# EAGLE design relayChain5Control (EAGLE 9.2.2)
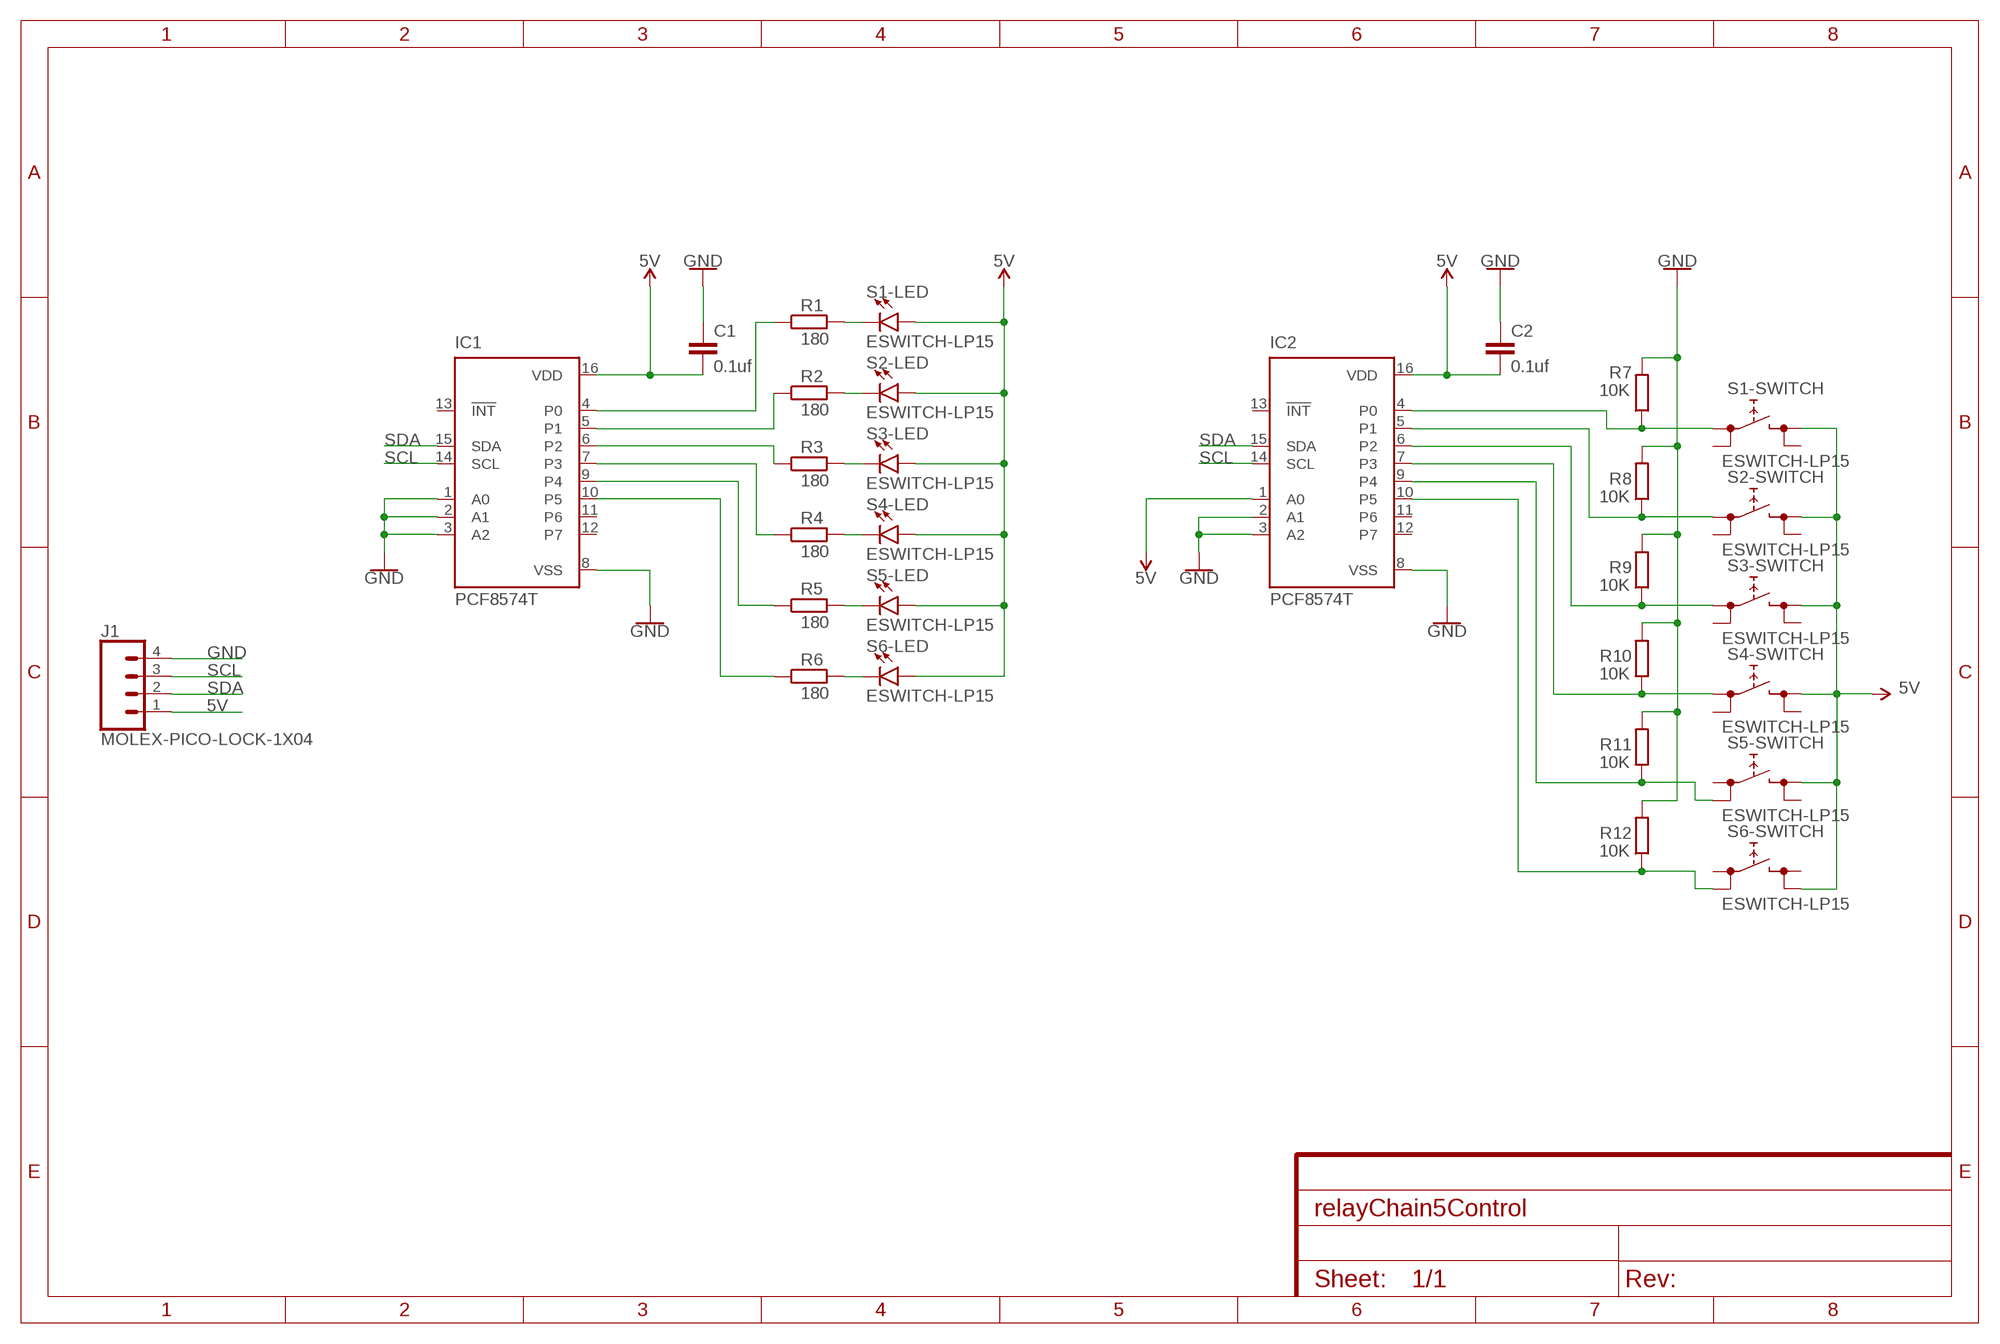
[diagram p0: schematic, sheet 1]

## Parts
C1  0.1uf  C-EUC0805  [C0805]
C2  0.1uf  C-EUC0805  [C0805]
IC1  PCF8574T  [SO16W]
IC2  PCF8574T  [SO16W]
J1  MOLEX-PICO-LOCK-1X04  [MOLEX-PICO-LOCK-1X04]
R1  180  R-EU_R2012  [R2012]
R2  180  R-EU_R2012  [R2012]
R3  180  R-EU_R2012  [R2012]
R4  180  R-EU_R2012  [R2012]
R5  180  R-EU_R2012  [R2012]
R6  180  R-EU_R2012  [R2012]
R7  10K  R-EU_R2012  [R2012]
R8  10K  R-EU_R2012  [R2012]
R9  10K  R-EU_R2012  [R2012]
R10  10K  R-EU_R2012  [R2012]
R11  10K  R-EU_R2012  [R2012]
R12  10K  R-EU_R2012  [R2012]
S1  ESWITCH-LP15  [ESWITCH-LP15]
S2  ESWITCH-LP15  [ESWITCH-LP15]
S3  ESWITCH-LP15  [ESWITCH-LP15]
S4  ESWITCH-LP15  [ESWITCH-LP15]
S5  ESWITCH-LP15  [ESWITCH-LP15]
S6  ESWITCH-LP15  [ESWITCH-LP15]

## Nets
5V: C1.2 C2.2 IC1.16(VDD) IC2.1(A0) IC2.16(VDD) J1.1 S1.P$3 S1.P$5(-LED:A) S2.P$3 S2.P$5(-LED:A) S3.P$3 S3.P$5(-LED:A) S4.P$3 S4.P$5(-LED:A) S5.P$3 S5.P$5(-LED:A) S6.P$4 S6.P$5(-LED:A)
GND: C1.1 C2.1 IC1.1(A0) IC1.2(A1) IC1.3(A2) IC1.8(VSS) IC2.2(A1) IC2.3(A2) IC2.8(VSS) J1.4 R7.2 R8.2 R9.2 R10.2 R11.2 R12.2
N$1: IC1.4(P0) R1.1
N$2: R1.2 S1.P$6(-LED:C)
N$3: IC1.5(P1) R2.1
N$4: IC1.6(P2) R3.1
N$5: IC2.4(P0) R7.1 S1.P$1
N$6: IC2.5(P1) R8.1 S2.P$1
N$7: R2.2 S2.P$6(-LED:C)
N$8: IC2.6(P2) R9.1 S3.P$1
N$9: IC2.7(P3) R10.1 S4.P$1
N$10: IC2.9(P4) R11.1 S5.P$2
N$11: IC1.7(P3) R4.1
N$12: IC1.9(P4) R5.1
N$13: R3.2 S3.P$6(-LED:C)
N$14: IC2.10(P5) R12.1 S6.P$2
N$15: R4.2 S4.P$6(-LED:C)
N$16: R5.2 S5.P$6(-LED:C)
N$17: R6.2 S6.P$6(-LED:C)
N$18: IC1.10(P5) R6.1
SCL: IC1.14(SCL) IC2.14(SCL) J1.3
SDA: IC1.15(SDA) IC2.15(SDA) J1.2
Unconnected: IC1.11(P6) IC1.12(P7) IC1.13(!INT) IC2.11(P6) IC2.12(P7) IC2.13(!INT) S1.P$2 S1.P$4 S2.P$2 S2.P$4 S3.P$2 S3.P$4 S4.P$2 S4.P$4 S5.P$1 S5.P$4 S6.P$1 S6.P$3

## Library data of the parts
C1 C2 = rcl:C-EU: CAPACITOR, European symbol; SPICEPREFIX: C
IC1 IC2 = micro-philips:PCF8574: I2C-Bus Remote 8-bit I/O expander http://www.semiconductors.philips.com/acrobat_download/datasheets/PCF8574_4.pdf; MPN: PCF8574T/3,512; OC_FARNELL: 1201255; OC_NEWARK: 70R6870
J1 = My-SMD-Library:MOLEX-PICO-LOCK-1X04
R1-R12 = rcl:R-EU_: RESISTOR, European symbol; SPICEPREFIX: R
S1-S6 = My-SMD-Library:ESWITCH-LP15?*

## Board
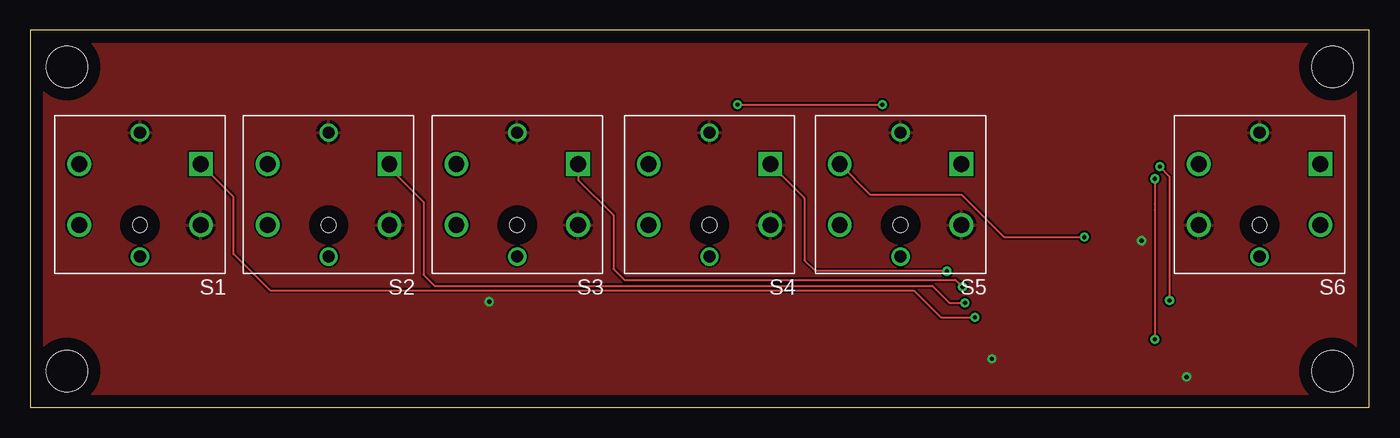
[diagram p1: board, top side]
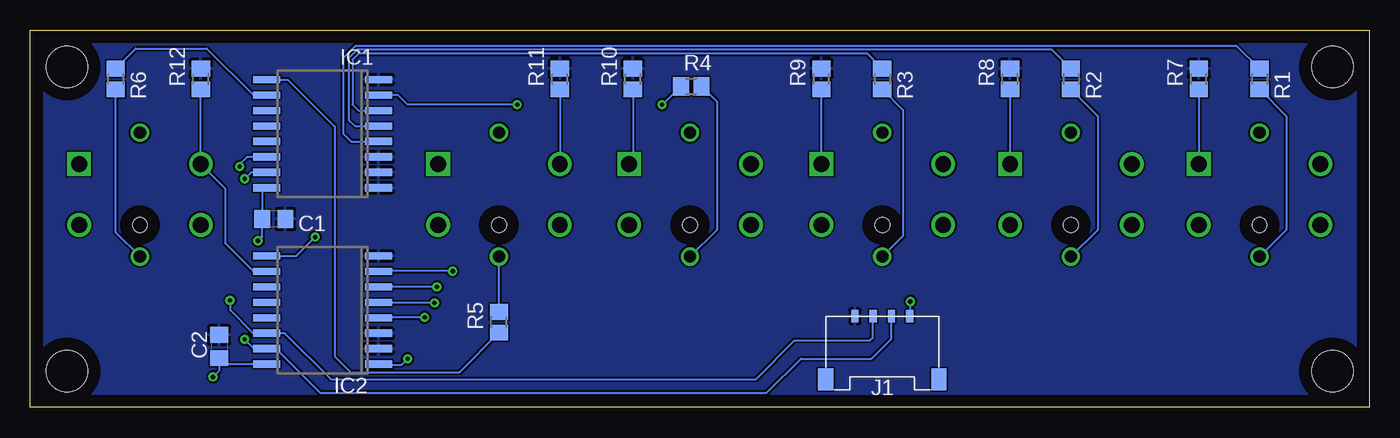
[diagram p2: board, bottom side, seen from below]

Size 110 x 31 mm. Coordinates in mm from the lower left corner, seen from the top.
Outline: 0,0 110,0 110,31 0,31 0,0
Copper layers (1*16): Top 0.035mm / dielectric 1.5mm / Bottom 0.035mm
Design rules "default": minimum track width 6mil, minimum drill 0.35mm, track to track 6mil, track to pad 6mil, pad to pad 6mil, via to via 6mil, smd to smd 6mil, copper to edge 40mil, drill to drill 6mil, minimum pad ring 10mil, minimum via ring 8mil, stop-mask expansion 4mil, vias tented up to drill 0mil, thermal gap 10mil
Holes 3.4 mm at 3,3 3,28 107,28 107,3

### Footprints (pad centres in the part's own frame; a part is rotated, then mirrored left to right if it is on the bottom)
C0805 = smd 1.3 x 1.5: 1 -0.95,0; 2 0.95,0
SO16W = smd 0.6 x 2.2: 1 -4.445,-4.6; 2 -3.175,-4.6; 3 -1.905,-4.6; 4 -0.635,-4.6; 5 0.635,-4.6; 6 1.905,-4.6; 7 3.175,-4.6; 8 4.445,-4.6; 9 4.445,4.6; 10 3.175,4.6; 11 1.905,4.6; 12 0.635,4.6; 13 -0.635,4.6; 14 -1.905,4.6; 15 -3.175,4.6; 16 -4.445,4.6
MOLEX-PICO-LOCK-1X04 = smd 0.6 x 1: 1 -2.25,0; 2 -0.75,0; 3 0.75,0; 4 2.25,0 | smd 1.25 x 1.8: S1 -4.65,5.2; S2 4.65,5.2
R2012 = smd 1.3 x 1.5: 1 -0.85,0; 2 0.85,0
ESWITCH-LP15 = drill 1.3 square: P$1 -5,-5 | drill 1.3: P$2 5,-5; P$3 -5,0; P$4 5,0 | drill 1: P$5 0,-7.6; P$6 0,2.6 | hole 1.2: 0,0

### Placement (x,y rotation side)
C1  90,15.5 180 bottom
C2  94.5,5 270 bottom
IC1  86,22.5 90 bottom
IC2  86,8 90 bottom
J1  40,7.5 180 bottom
R1  9,27 270 bottom
R2  24.5,27 270 bottom
R3  40,27 270 bottom
R4  55.7,26.4 0 bottom
R5  71.5,7 90 bottom
R6  103,27 270 bottom
R7  14,27 90 bottom
R8  29.5,27 90 bottom
R9  45,27 90 bottom
R10  60.5,27 90 bottom
R11  66.5,27 90 bottom
R12  96,27 90 bottom
S1  9,15 180 top
S2  24.5,15 180 top
S3  40,15 180 top
S4  55.8,15 180 top
S5  71.5,15 180 top
S6  101,15 180 top

### Tracks (layer width: path | path; a pad name or v marks a point on that pad's centre or on a via)
5V  (via drill 0.35)
  Bottom 0.152: J1.1 37.7,7.55 v37.7,8.7 | IC2.16 94,3.56 C2.2 94.5,3 v95,2.5 | IC2.1 81.34,3.5 79.5,3.5 v79,4 | IC1.16 90.95,17.7 C1.2 90.95,14.05 v91.3,13.7
  pour Top: 0.5,30.5 109.5,30.5 109.5,0.5 0.5,0.5
GND
  pour Bottom: 0.5,30.5 0.5,0.5 109.5,0.5 109.5,30.5
N$1
  Bottom 0.152: R1.1 10.85,29.7 83.3,29.7 84.3,28.7 84.3,22.5 83.67,21.86 IC1.4
N$2
  Bottom 0.152: R1.2 6.8,23.95 6.8,14.6 S1.P$6
N$3
  Bottom 0.152: R2.1 26.05,29.39 83.17,29.39 83.83,28.73 83.83,23.63 83.33,23.14 IC1.5
N$4
  Bottom 0.152: R3.1 41.24,29.09 83.05,29.09 83.53,28.61 83.53,24.9 83.03,24.41 IC1.6
N$5  (via drill 0.35)
  Top 0.152: v77.6,7.4 74.8,7.4 72.6,9.6 19.7,9.6 16.7,12.6 16.7,17.3 S1.P$1
  Bottom 0.152: R7.1 S1.P$1 | v77.6,7.4 81.36,7.4 IC2.4
N$6  (via drill 0.35)
  Top 0.152: v76.8,8.6 75.5,8.6 74.1,10 33.2,10 32.3,10.9 32.3,16.9 29.5,19.7 S2.P$1
  Bottom 0.152: v76.8,8.6 81.36,8.6 IC2.5 | R8.1 S2.P$1
N$7
  Bottom 0.152: R2.2 22.3,23.95 22.3,14.6 S2.P$6
N$8  (via drill 0.35)
  Top 0.152: S3.P$1 45,18.7 47.9,15.8 47.9,11.4 48.8,10.5 76,10.5 v76.6,9.9
  Bottom 0.152: v76.6,9.9 IC2.6 | S3.P$1 R9.1
N$9  (via drill 0.35)
  Top 0.152: S4.P$1 63.6,17.2 63.6,12.1 64.5,11.2 v75.3,11.2
  Bottom 0.152: v75.3,11.2 81.38,11.2 IC2.7 | R10.1 60.5,20.3 S4.P$1
N$10  (via drill 0.35)
  Top 0.152: S5.P$2 69,17.5 76.5,17.5 80,14 v86.6,14
  Bottom 0.152: R11.1 S5.P$2 | IC2.9 88.16,12.45 v86.6,14
N$11  (via drill 0.35)
  Top 0.152: v58.1,24.9 v70,24.9
  Bottom 0.152: R4.1 58.05,24.9 v58.1,24.9 | v58.1,24.9 58.2,24.9 v58.1,24.9 | v70,24.9 79,24.9 79.78,25.68 IC1.7
N$12
  Bottom 0.152: IC1.9 88.84,26.95 85,23.1 85,4.2 83.7,2.9 74.75,2.9 R5.1
N$13
  Bottom 0.152: R3.2 38.3,24.45 38.3,14.1 S3.P$6
N$14
  Bottom 0.152: IC2.10 91.67,11.18 94,13.5 94,18 S6.P$2 R12.1
N$15
  Bottom 0.152: R4.2 53.6,25.15 53.6,14.6 S4.P$6
N$16
  Bottom 0.152: R5.2 S5.P$6
N$17
  Bottom 0.152: S6.P$6 103,14.4 R6.2
N$18
  Bottom 0.152: R6.1 101.35,29.5 95.5,29.5 91.67,25.68 IC1.10
SCL  (via drill 0.35)
  Top 0.152: v93.6,8.8 v93.61,8.81 93.61,18.99 v92.8,19.8
  Bottom 0.152: IC1.14 92.2,20.59 92.8,20 v92.8,19.8 | v93.6,8.8 93.6,8 91.69,6.09 IC2.14 89.09,6.09 85.3,2.3 50.4,2.3 47.2,5.5 41,5.5 40.8,5.7 40.8,7.45 J1.3
SDA  (via drill 0.35)
  Top 0.152: v92.4,18.8 92.4,16.76 92.39,16.75 92.39,16.25 92.4,16.24 v92.4,5.6
  Bottom 0.152: IC1.15 91.88,19.32 v92.4,18.8 | v92.4,5.6 91.62,4.83 IC2.15 89.83,4.83 86.2,1.2 49.5,1.2 46.7,4 40.9,4 39.25,5.65 J1.2